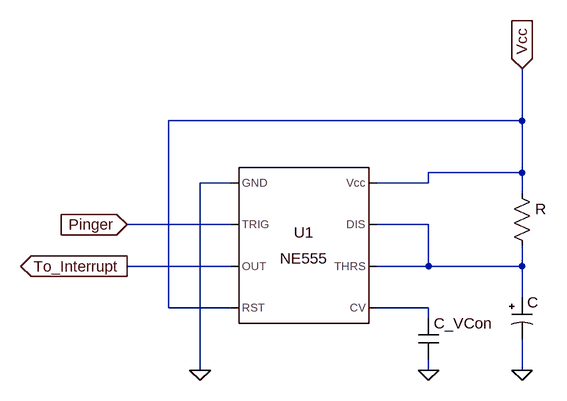
[diagram p0: schematic 555 Timer Circuit.asc]
555 Timer Circuit.asc, the LTspice schematic file:
Version 4
SHEET 1 1080 680
WIRE 784 80 784 0
WIRE 784 80 240 80
WIRE 784 160 784 80
WIRE 784 160 640 160
WIRE 336 176 288 176
WIRE 640 176 640 160
WIRE 640 176 560 176
WIRE 784 192 784 160
WIRE 336 240 176 240
WIRE 640 240 560 240
WIRE 336 304 176 304
WIRE 640 304 640 240
WIRE 640 304 560 304
WIRE 784 304 784 272
WIRE 784 304 640 304
WIRE 784 352 784 304
WIRE 240 368 240 80
WIRE 336 368 240 368
WIRE 640 368 560 368
WIRE 640 384 640 368
WIRE 288 464 288 176
WIRE 640 464 640 448
WIRE 784 464 784 416
FLAG 288 464 0
FLAG 784 464 0
FLAG 784 0 Vcc
IOPIN 784 0 In
FLAG 176 240 Pinger
IOPIN 176 240 In
FLAG 176 304 To_Interrupt
IOPIN 176 304 Out
FLAG 640 464 0
SYMBOL Misc/NE555 448 272 R0
SYMATTR InstName U1
SYMBOL polcap 768 352 R0
SYMATTR InstName C
SYMATTR Value ""
SYMBOL res 768 176 R0
SYMATTR InstName R
SYMATTR Value ""
SYMBOL cap 624 384 R0
SYMATTR InstName C_VCon
SYMATTR Value ""

The netlist it stands for:
* 555 Timer Circuit.asc
XU1 0 Pinger To_Interrupt Vcc N002 N001 N001 Vcc NE555  ; pins GND TRIG OUT RST CV THRS DIS Vcc
C N001 0
R Vcc N001
C_VCon N002 0
.lib NE555.sub
.backanno
.end